# Altium schematic sheet Voltage Sense.SchDoc
size 406 x 304 mm; SheetNumber: 8; SheetTotal: 14
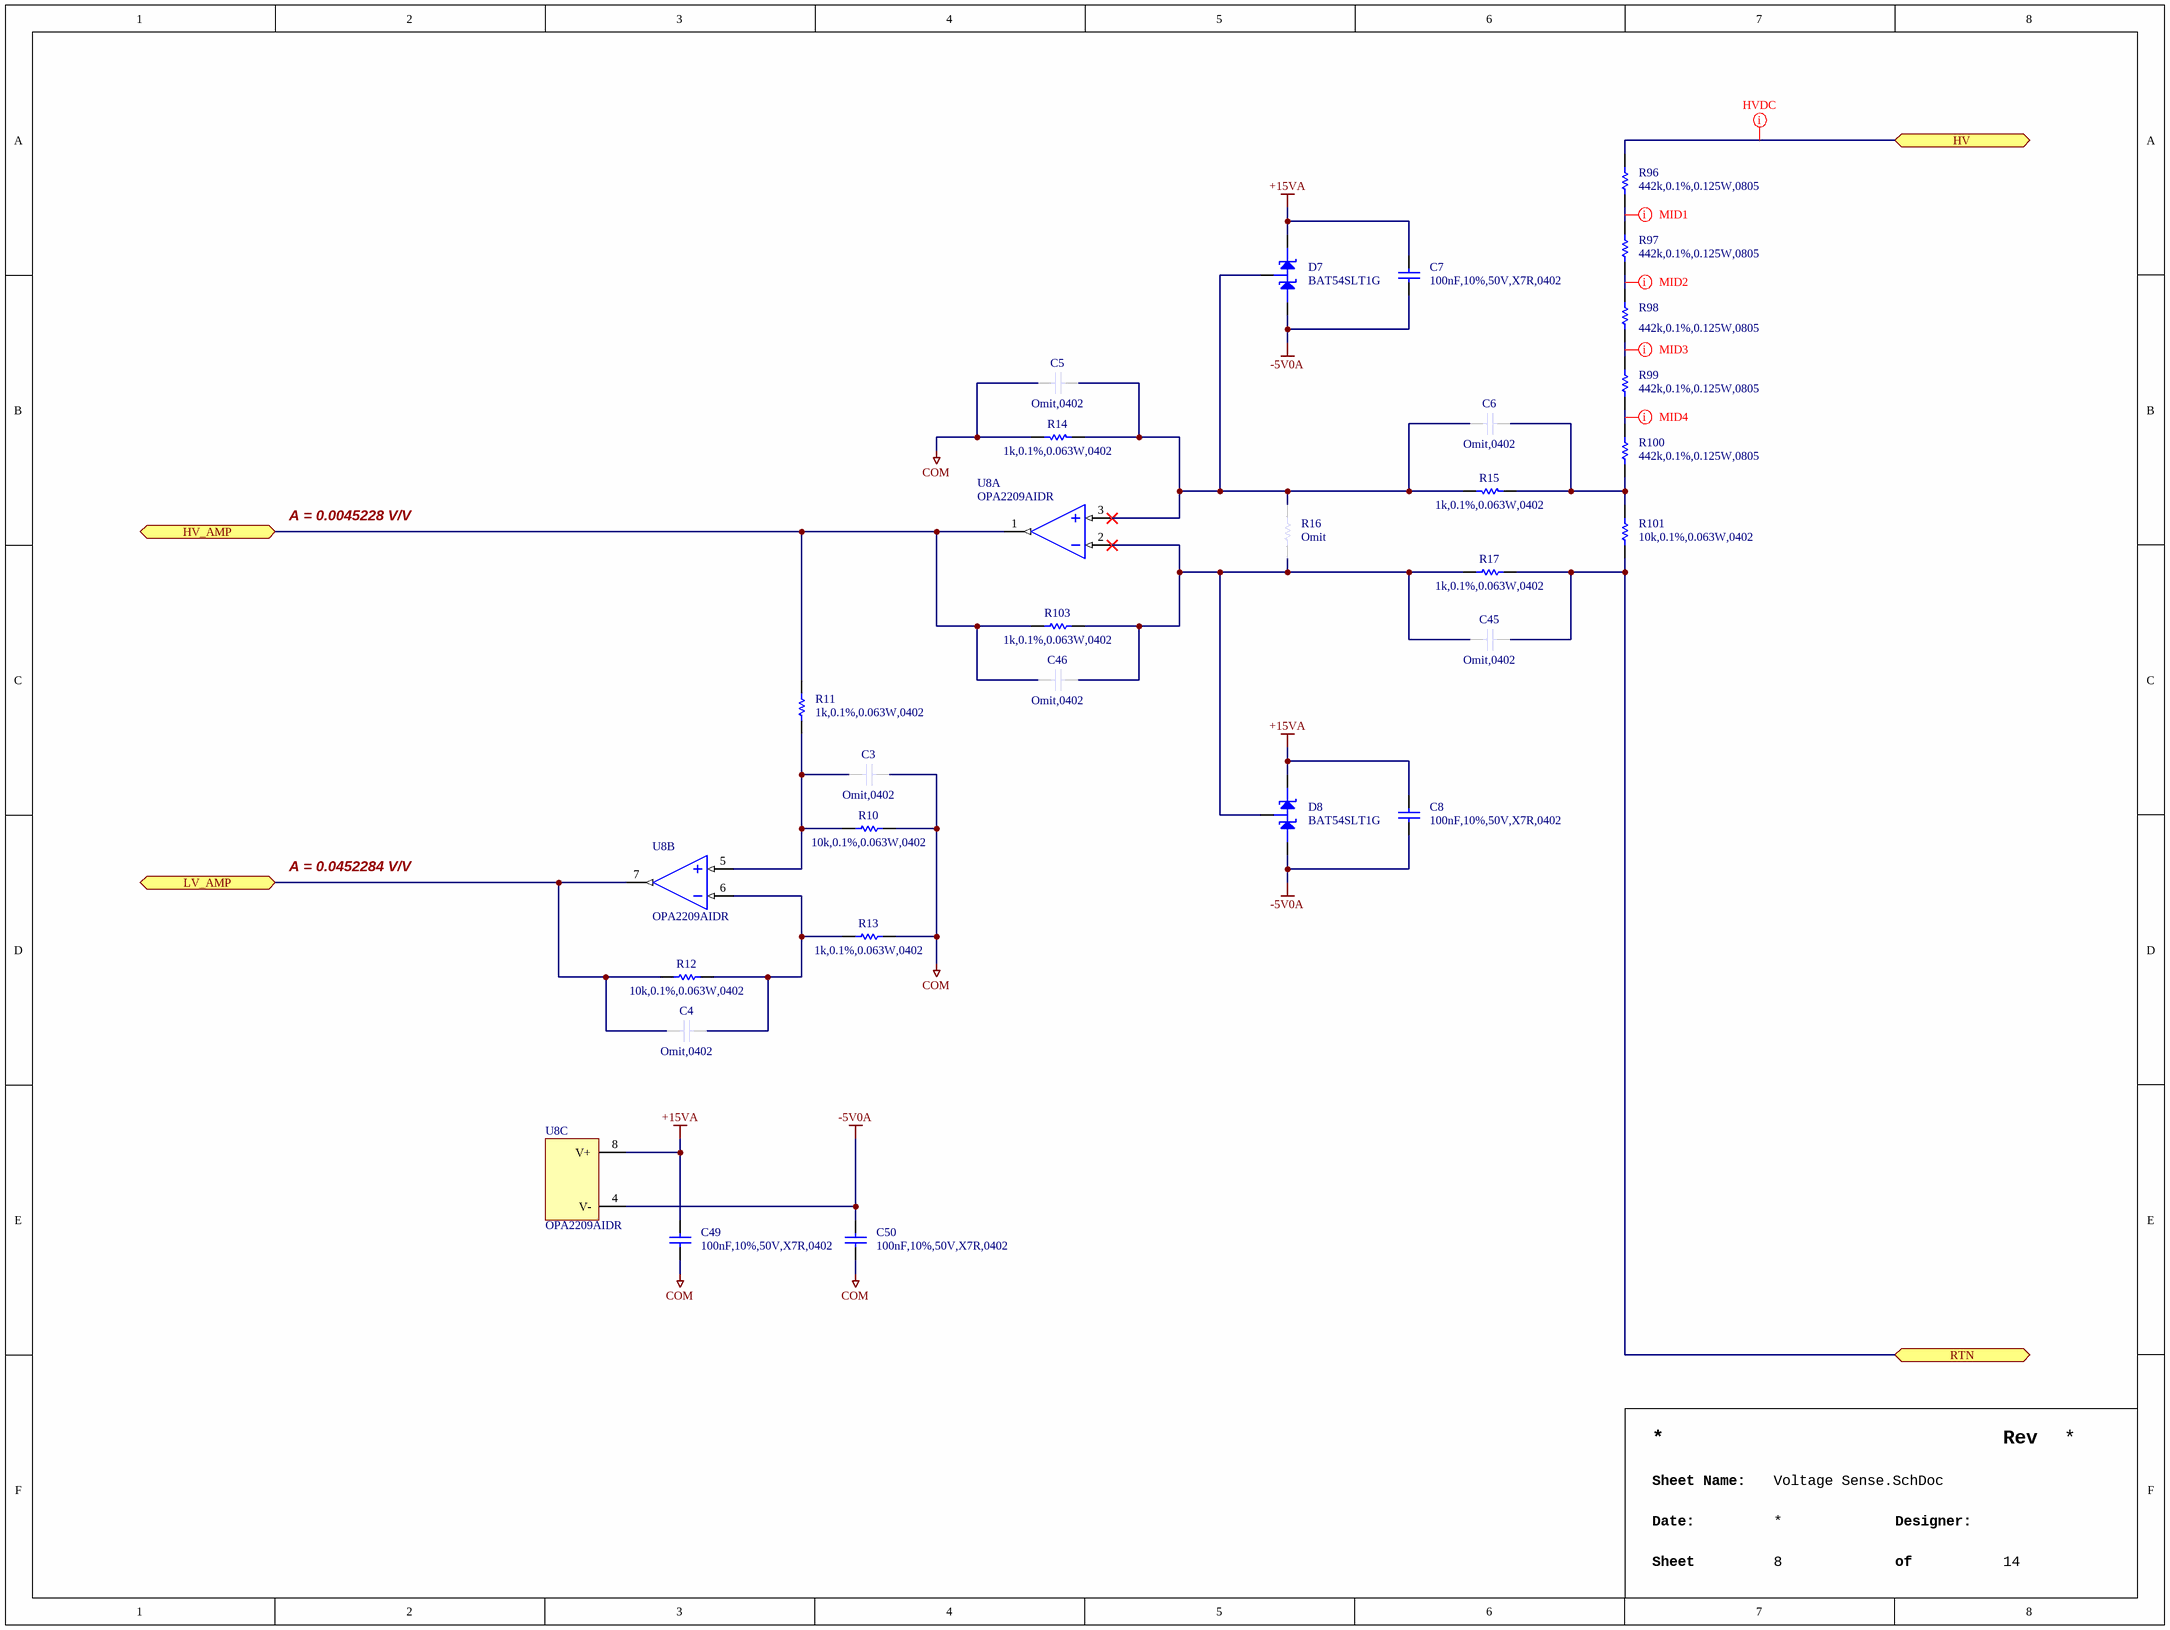
[diagram p0: Voltage Sense.SchDoc]

## Parts
C3  Omit,0402  [CAPC1005X06N]  (no BOM)
C4  Omit,0402  [CAPC1005X06N]  (no BOM)
C5  Omit,0402  [CAPC1005X06N]  (no BOM)
C6  Omit,0402  [CAPC1005X06N]  (no BOM)
C7  100nF,10%,50V,X7R,0402  [CAPC1005X06N]
C8  100nF,10%,50V,X7R,0402  [CAPC1005X06N]
C45  Omit,0402  [CAPC1005X06N]  (no BOM)
C46  Omit,0402  [CAPC1005X06N]  (no BOM)
C49  100nF,10%,50V,X7R,0402  [CAPC1005X06N]
C50  100nF,10%,50V,X7R,0402  [CAPC1005X06N]
D7  BAT54SLT1G  [SOT95P240X120-3N]
D8  BAT54SLT1G  [SOT95P240X120-3N]
R10  10k,0.1%,0.063W,0402  [RESC1005X04N]
R11  1k,0.1%,0.063W,0402  [RESC1005X04N]
R12  10k,0.1%,0.063W,0402  [RESC1005X04N]
R13  1k,0.1%,0.063W,0402  [RESC1005X04N]
R14  1k,0.1%,0.063W,0402  [RESC1005X04N]
R15  1k,0.1%,0.063W,0402  [RESC1005X04N]
R16  Omit  [RESC1005X04N]  (no BOM)
R17  1k,0.1%,0.063W,0402  [RESC1005X04N]
R96  442k,0.1%,0.125W,0805  [RESC2012X07N]
R97  442k,0.1%,0.125W,0805  [RESC2012X07N]
R98  442k,0.1%,0.125W,0805  [RESC2012X07N]
R99  442k,0.1%,0.125W,0805  [RESC2012X07N]
R100  442k,0.1%,0.125W,0805  [RESC2012X07N]
R101  10k,0.1%,0.063W,0402  [RESC1005X04N]
R103  1k,0.1%,0.063W,0402  [RESC1005X04N]
U8  OPA2209AIDR  [TEXASINSTRUMENTS_PKG_D0008A]  (parts A,B,C of 3)

## Ports
HV (bidir), HV_AMP (bidir), LV_AMP (bidir), RTN (bidir)

## Nets
+15VA: C7.2 C8.2 C49.2 D7.2(C) D8.2(C) U8.8(V+)
-5V0A: C7.1 C8.1 C50.2 D7.1(A) D8.1(A) U8.4(V-)
COM: C3.1 C5.1 C49.1 C50.1 R10.2 R13.1 R14.2
HV: R96.2 ; port HV
HV_AMP: C46.1 R11.1 R103.2 U8.1(OUTA) ; port HV_AMP
LV_AMP: C4.1 R12.2 U8.7(OUTB) ; port LV_AMP
RTN: C45.2 R17.1 R101.1 ; port RTN
NetC3_2: C3.2 R10.1 R11.2 U8.5(+INB)
NetC4_2: C4.2 R12.1 R13.2 U8.6(-INB)
NetC5_2: C5.2 C6.1 D7.3(C/A) R14.1 R15.2 R16.2 U8.3(+INA)
NetC6_2: C6.2 R15.1 R100.1 R101.2
NetC45_1: C45.1 C46.2 D8.3(C/A) R16.1 R17.2 R103.1 U8.2(-INA)
NetR96_1: R96.1 R97.2
NetR97_1: R97.1 R98.2
NetR98_1: R98.1 R99.2
NetR99_1: R99.1 R100.2

## Layout directives
net class MID1: NetR96_1
net class HVDC: HV
net class MID2: NetR97_1
net class MID3: NetR98_1
net class MID4: NetR99_1

## Notes on the sheet
- A = 0.0045228 V/V
- A = 0.0452284 V/V
- Rev
- Sheet Name:
- Date:
- Sheet
- Designer:
- of

## Library data of the parts
C3-C6 C45 C46 = CAP,Omit,0402: Omit; Part Name: CAP,Omit,0402; CreatedBy: Judd Foster; HelpURL: N/A; Manufacturer 1: N/A; Manufacturer 1 Part Number: N/A; Vendor 1: N/A; Vendor 1 Part Number: N/A; Value: Omit
C7 C8 C49 C50 = CAP,Cer,100nF,10%,50V,X7R,0402: 50V 100nF X7R Â±10% 0402 Ceramic Capacitors ROHS; Manufacturer 1: Murata; Manufacturer 1 Part Number: GRM155R71H104KE14D; Vendor 1 Part Number: C77020; Vendor 1: LCSC; Value: 100n; Part Name: CAP,Cer,100nF,10%,50V,X7R,0402; CreatedBy: Judd Foster; HelpURL: https://www.lcsc.com/datasheet/C77020.pdf
D7 D8 = DIODE,Array,Schottky,Series,30V,200mA,SOT23: Diode Array 1 Pair Series Connection 30 V 200mA (DC) Surface Mount TO-236-3, SC-59, SOT-23-3; Manufacturer 1: onsemi; Vendor 1 Part Number: BAT54SLT1GOSCT-ND; Vendor 1: Digikey; Part Name: DIODE,Array,Schottky,Series,30V,200mA,SOT23; CreatedBy: Judd Foster; HelpURL: https://www.onsemi.com/pdf/datasheet/bat54slt1-d.pdf; Manufacturer 1 Part Number: BAT54SLT1G
R10 R12 R101 = RES,10k,0.1%,0.063W,0402: 10 kOhms ï¿½0.1% 0.1W, 1/10W Chip Resistor 0402 (1005 Metric) Automotive AEC-Q200 Thin Film; Manufacturer 1: Stackpole Electronics Inc; Manufacturer 1 Part Number: RNCF0402BTE10K0; Vendor 1 Part Number: RNCF0402BTE10K0CT-ND; Vendor 1: Digikey; Part Name: RES,10k,0.1%,0.063W,0402; CreatedBy: Judd Foster; HelpURL: https://www.seielect.com/catalog/sei-rncf.pdf; Value: 10k
R11 R13-R15 R17 R103 = RES,1k,0.1%,0.063W,0402: 1 kOhms Â±0.1% 0.063W, 1/16W Chip Resistor 0402 (1005 Metric) Thin Film; Manufacturer 1: YAGEO; Manufacturer 1 Part Number: RT0402BRE071KL; Vendor 1 Part Number: YAG2306CT-ND; Vendor 1: DigiKey; Part Name: RES,1k,0.1%,0.063W,0402; CreatedBy: Judd Foster; HelpURL: https://www.yageo.com/upload/media/product/app/datasheet/rchip/pyu-rt_1-to-0.01_rohs_l.pdf; Value: 1k
R16 = RES,Omit,0402: Part Name: RES,Omit,0402; CreatedBy: Judd Foster; HelpURL: N/A; Manufacturer 1: N/A; Manufacturer 1 Part Number: N/A; Vendor 1: N/A; Vendor 1 Part Number: N/A; Value: Omit
R96-R100 = RES,442k,0.1%,0.125W,0805: 442 kOhms Â±0.1% 0.125W, 1/8W Chip Resistor 0805 (2012 Metric) Automotive AEC-Q200 Thin Film; Manufacturer 1: Panasonic Electronic Components; Manufacturer 1 Part Number: ERA-6AEB4423V; Vendor 1 Part Number: P442KDACT-ND; Vendor 1: DigiKey; Part Name: RES,442k,0.1%,0.125W,0805; CreatedBy: Judd Foster; HelpURL: https://industrial.panasonic.com/cdbs/www-data/pdf/RDM0000/AOA0000C307.pdf; Value: 442k
U8 = OPA2209AIDR: 35uV 18MHz 4.5nA 6.4V/us 130dB SOIC-8 Amplifiers ROHS; Manufacturer 1: Texas Instruments; Vendor 1 Part Number: C2057330; Vendor 1: LCSC; Part Name: OPA2209AIDR; CreatedBy: Judd Foster; HelpURL: https://www.lcsc.com/datasheet/C2057330.pdf; Manufacturer 1 Part Number: OPA2209AIDR